# EAGLE design SignalMast-ColorLight-SingleHead (EAGLE 7.7.0)
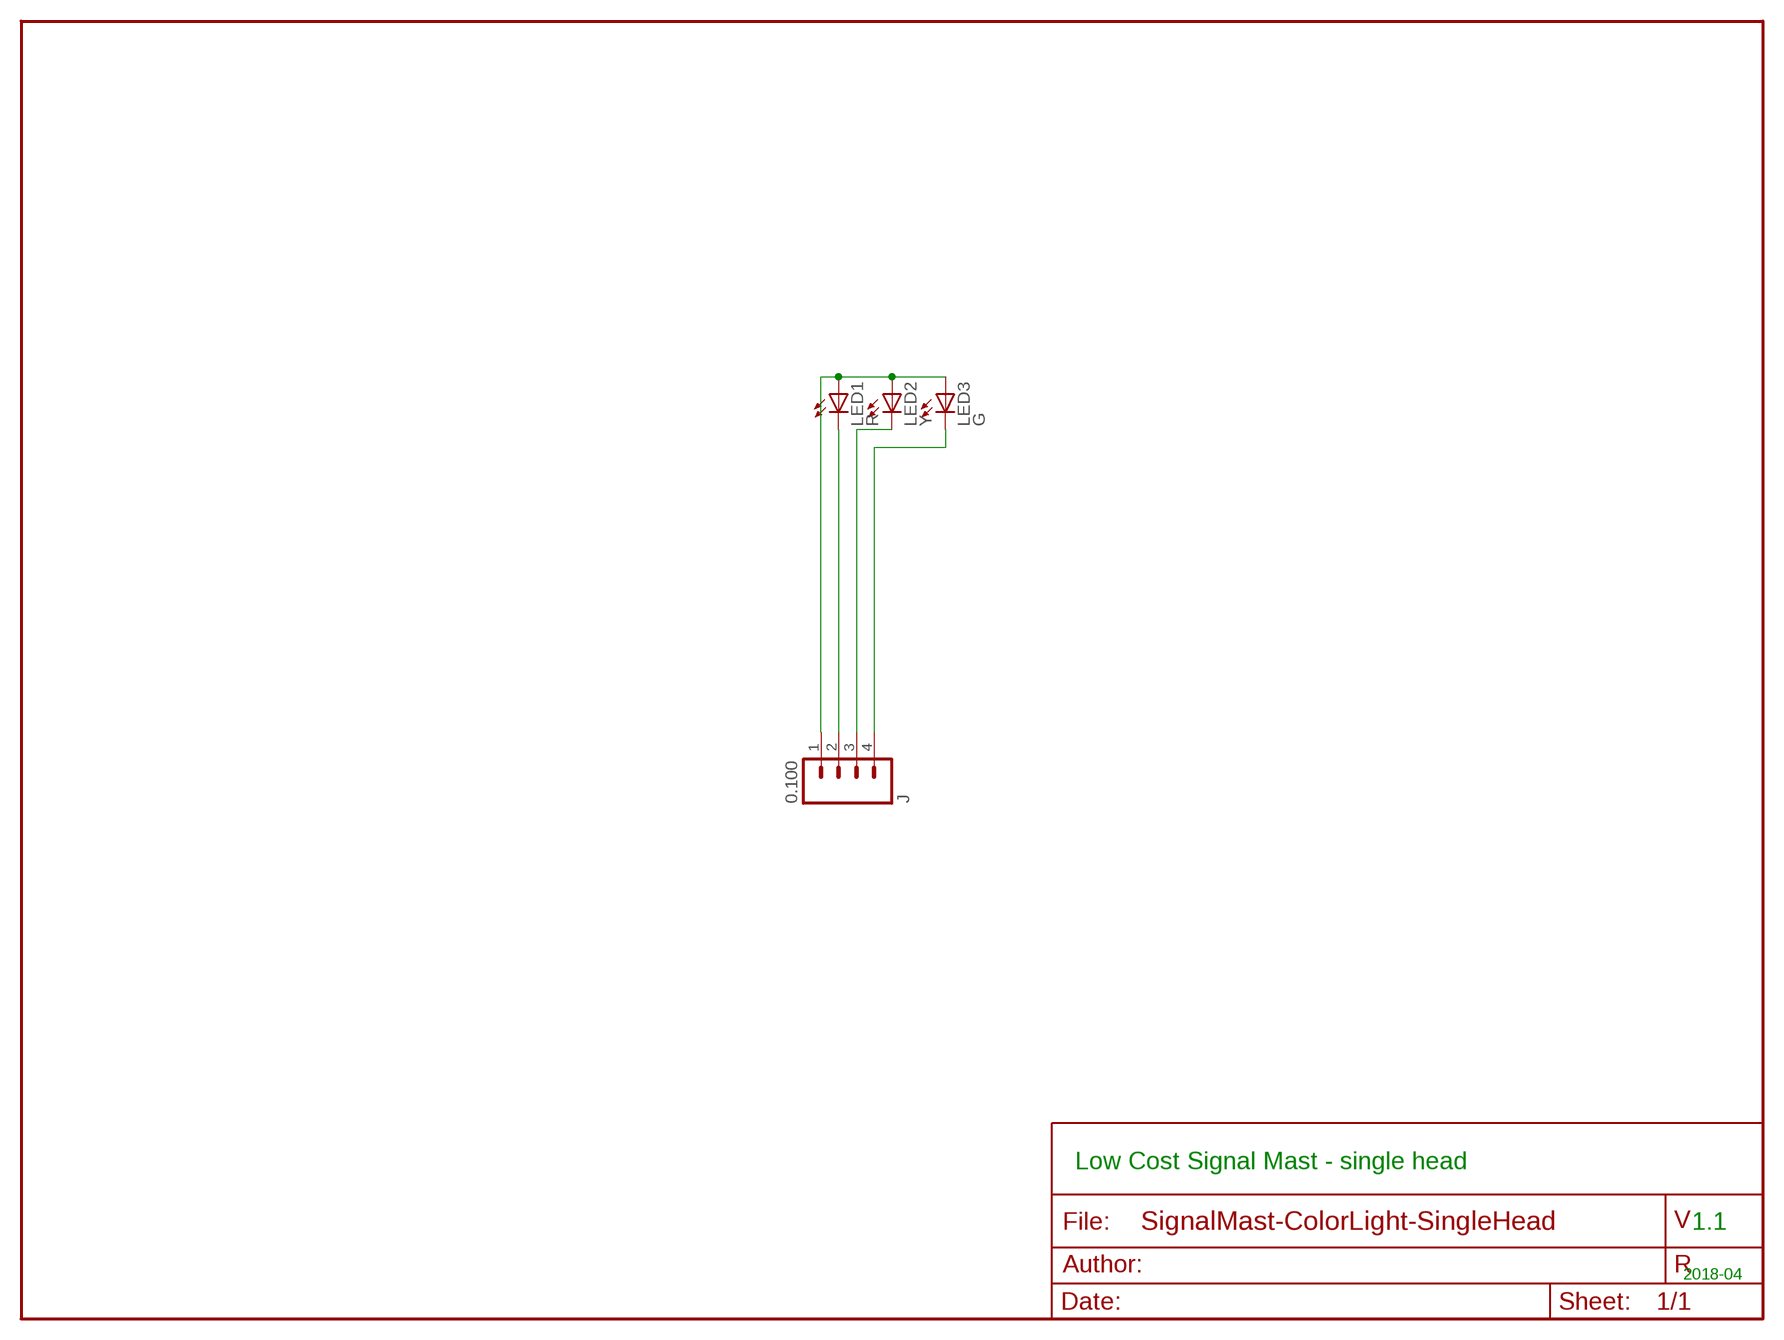
[diagram p0: schematic, sheet 1]

## Parts
J  0.100  CONNECTOR-M04LOCK  [1X04_LOCK]
LED1  R  LED0603-LED  [0603-LED]
LED2  Y  LED0603-LED  [0603-LED]
LED3  G  LED0603-LED  [0603-LED]

## Nets
BG: J.4 LED3.C
BR: J.2 LED1.C
BV+: J.1 LED1.A LED2.A LED3.A
BY: J.3 LED2.C

## Notes on the sheet
- Low Cost Signal Mast - single head
- 1.1
- 2018-04

## Library data of the parts
J = SPCoast:CONNECTOR-M04: Header 4 Standard 4-pin 0.1" header. Use with straight break away headers (SKU : PRT-00116), right angle break away headers (PRT-00553), swiss pins (PRT-00743), machine pins (PRT-00117), and female headers (PRT-00115). Molex polarized connector foot print use with SKU : PRT-08231 with associated crimp pins and housings. 1MM SMD Version SKU: PRT-10208
LED1 = SPCoast:LED*; OPL: 19-217-R6C-AL1M2VY-3T
LED2 = SPCoast:LED*; OPL: 19-217-Y5C-AM1N1VY-3T
LED3 = SPCoast:LED*; OPL: 19-217-G7C-AN1P2-3T

## Net classes
0 default: width 0.203 mm

## Board
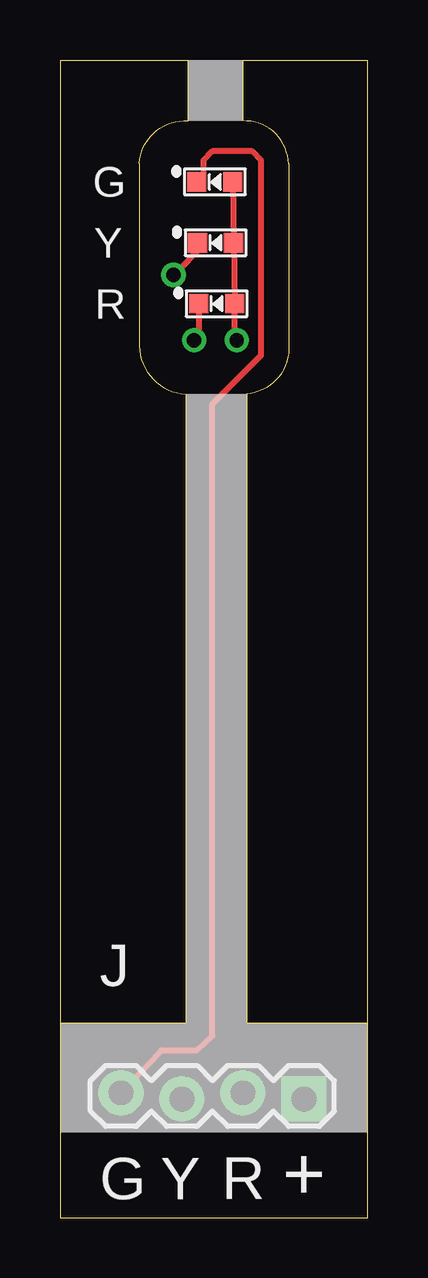
[diagram p1: board, top side]
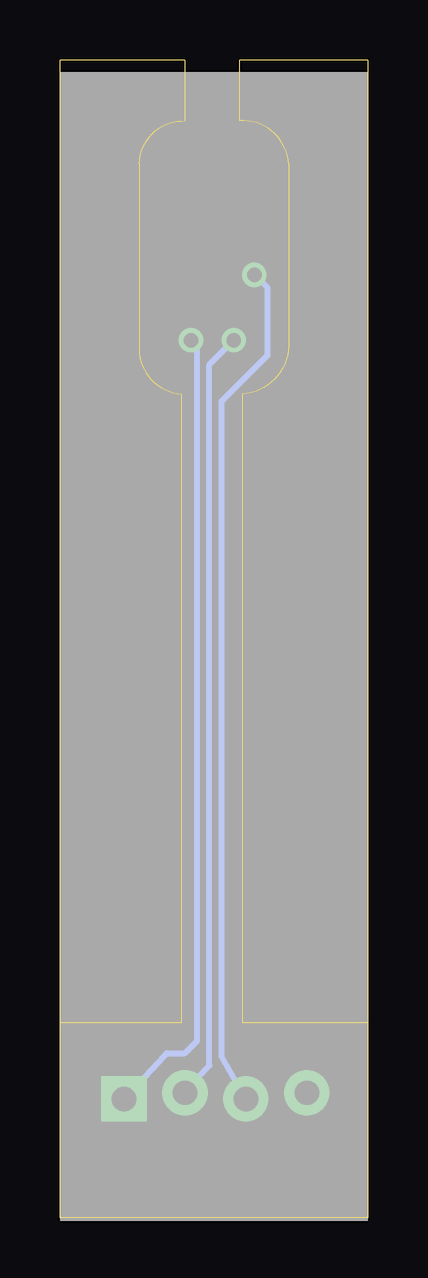
[diagram p2: board, bottom side, seen from below]

Size 12.83 x 48.26 mm. Coordinates in mm from the lower left corner, seen from the top.
Outline: 0,8.13 5.23,8.13 5.23,34.33 arc-90 3.3,36.52 3.3,43.94 arc-90 5.33,45.72 5.33,48.26 0,48.26 0,0 12.83,0 12.83,8.13
Outline: 12.83,8.13 7.77,8.13 7.77,34.33 arc90 9.53,36.4 9.53,43.94 arc90 7.62,45.72 7.62,48.26 12.83,48.26 12.83,8.13
Copper layers (1*16): Top 0.035mm / dielectric 1.5mm / Bottom 0.035mm
Design rules "default": minimum track width 10mil, minimum drill 24mil, track to track 8mil, track to pad 8mil, pad to pad 8mil, via to via 8mil, smd to smd 8mil, copper to edge 40mil, drill to drill 8mil, minimum pad ring 10mil, minimum via ring 8mil, stop-mask expansion 4mil, vias tented up to drill 0mil, thermal gap 10mil

### Footprints (pad centres in the part's own frame; a part is rotated, then mirrored left to right if it is on the bottom)
1X04_LOCK = drill 1.016 pad 1.88 square: 1 0,0.127 | drill 1.016 pad 1.88: 2 2.54,-0.127; 3 5.08,0.127; 4 7.62,-0.127
0603-LED = smd 0.8 x 0.8: A 0.75,0; C -0.75,0

### Placement (x,y rotation side)
J  10.16,5.08 180 top
LED1  6.53,38.1 0 top
LED2  6.48,40.64 0 top
LED3  6.45,43.18 0 top

### Tracks (layer width: path | path; a pad name or v marks a point on that pad's centre or on a via)
BG
  Top 0.254: J.4 4.24,6.99 5.71,6.99 6.35,7.57 6.35,33.92 8.38,35.96 8.38,44.07 8,44.45 6.35,44.45 5.97,44.07 5.97,43.09 LED3.C
BR  (via drill 0.6)
  Top 0.254: LED1.C 5.78,37.02 v5.59,36.58
  Bottom 0.254: J.2 7.11,5.06 7.11,5.84 6.6,6.35 6.6,35.56 v5.59,36.58
BV+  (via drill 0.6)
  Top 0.254: 7.49,37.91 LED1.A | LED3.A LED2.A LED1.A | v7.37,36.58 7.28,36.79 LED1.A
  Bottom 0.254: J.1 8.46,6.78 8.38,6.86 7.62,6.86 7.11,7.37 7.11,36.2 v7.37,36.58
BY  (via drill 0.6)
  Top 0.254: v4.73,39.3 5.98,40.57 LED2.C
  Bottom 0.254: J.3 6.1,6.71 6.1,34.04 4.19,35.94 4.19,38.76 v4.73,39.3

### Text on the board
tPlace: G | Y | R | +